# Altium schematic sheet PLWD_Battery_Charger.SchDoc
size A3; SheetNumber: 9; SheetTotal: 11
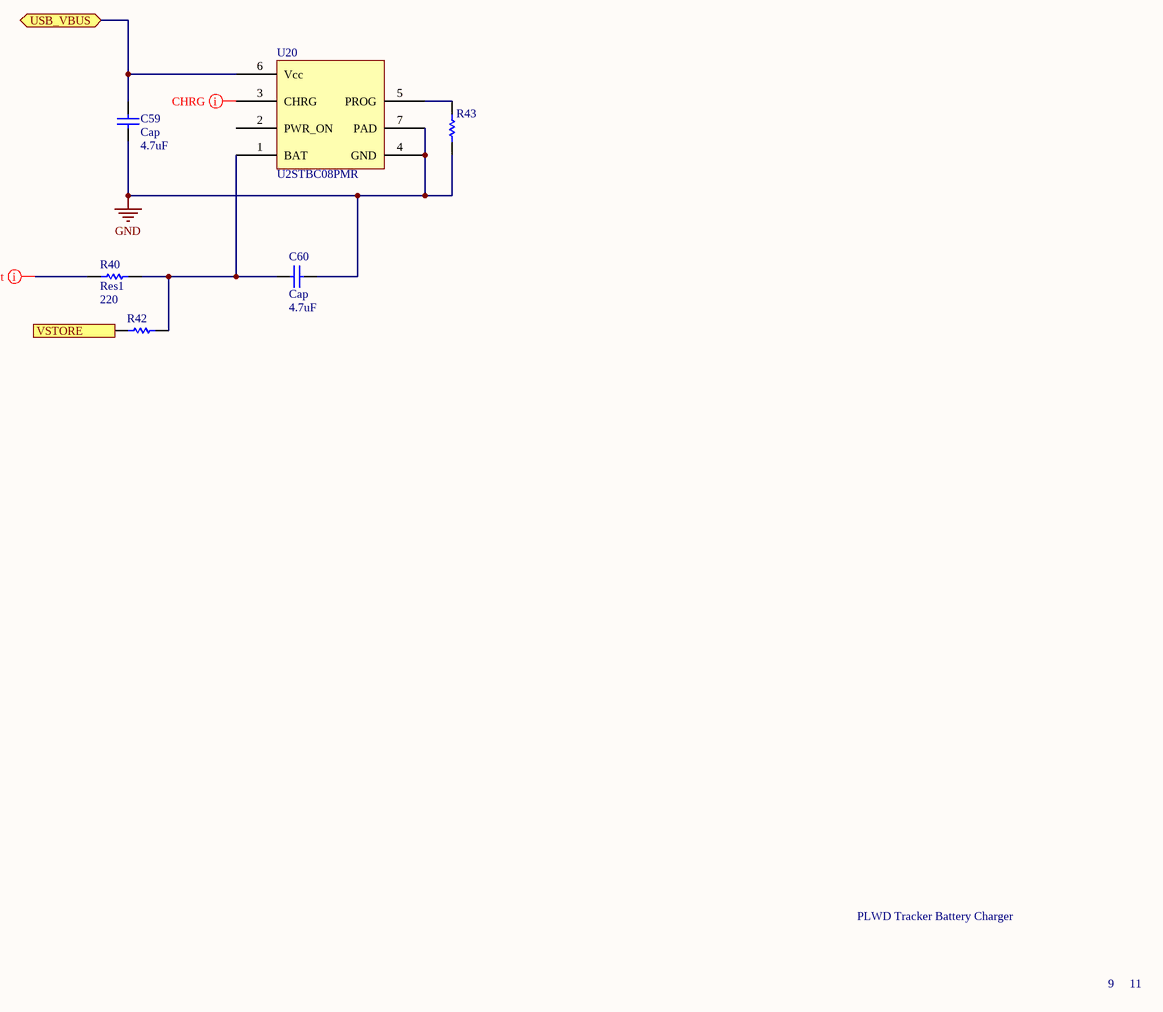
[diagram p0: PLWD_Battery_Charger.SchDoc]

## Parts
C59  Cap  value 4.7uF  [RAD-0.3]
C60  Cap  value 4.7uF  [RAD-0.3]
R40  Res1  value 220  [AXIAL-0.3]
R42  Res1  [AXIAL-0.3]  (value not drawn)
R43  Res1  [AXIAL-0.3]  (value not drawn)
U20  U2STBC08PMR

## Ports
USB_VBUS (bidir), VSTORE

## Nets
GND: C59.1 C60.1 R43.2 U20.4(GND) U20.7(PAD)
USB_VBUS: C59.2 U20.6(Vcc) ; port USB_VBUS
VSTORE: R42.1 ; port VSTORE
NetC60_2: C60.2 R40.2 R42.2 U20.1(BAT)
NetR43_1: R43.1 U20.5(PROG)

Not connected (* = marked no-connect by the designer): R40 1; U20 2(PWR_ON) 3(CHRG)

## Layout directives
mark named CHRG: NetU20_3
mark named VBat: NetR40_1

## Notes on the sheet
- PLWD Tracker Battery Charger
- 9
- 11

## Library data of the parts
C59 C60 = Cap: Capacitor; Published: 8-Jun-2000; LatestRevisionDate: 17-Jul-2002; LatestRevisionNote: Re-released for DXP Platform.; PackageReference: RAD-0.3; Publisher: Altium Limited; PackageDescription: Radial Cap, Thru-Hole; 2 Leads; 0.3 in Pin Spacing
R40 = Res1: Resistor; Published: 8-Jun-2000; LatestRevisionDate: 17-Jul-2002; LatestRevisionNote: Re-released for DXP Platform.; PackageReference: AXIAL-0.3; Publisher: Altium Limited; PackageDescription: Axial Device, Thru-Hole; 2 Leads; 0.3 in Pin Spacing
R42 R43 = Res1: Resistor; Value: 261; Published: 8-Jun-2000; LatestRevisionDate: 17-Jul-2002; LatestRevisionNote: Re-released for DXP Platform.; PackageReference: AXIAL-0.3; Publisher: Altium Limited; PackageDescription: Axial Device, Thru-Hole; 2 Leads; 0.3 in Pin Spacing